# EAGLE design d1 (EAGLE 9.3.2)
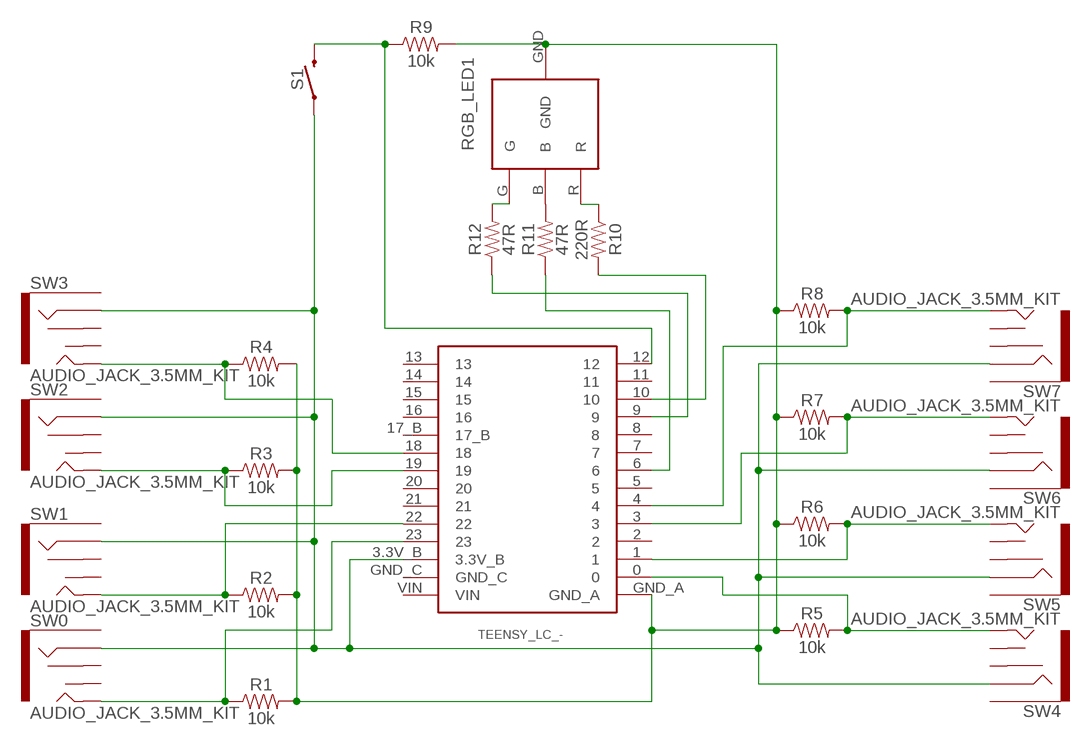
[diagram p0: schematic, sheet 1]

## Parts
R1  10k  10KOHM-HORIZ_KIT-1/4W-1%  [AXIAL-0.3-KIT]
R2  10k  10KOHM-HORIZ_KIT-1/4W-1%  [AXIAL-0.3-KIT]
R3  10k  10KOHM-HORIZ_KIT-1/4W-1%  [AXIAL-0.3-KIT]
R4  10k  10KOHM-HORIZ_KIT-1/4W-1%  [AXIAL-0.3-KIT]
R5  10k  10KOHM-HORIZ_KIT-1/4W-1%  [AXIAL-0.3-KIT]
R6  10k  10KOHM-HORIZ_KIT-1/4W-1%  [AXIAL-0.3-KIT]
R7  10k  10KOHM-HORIZ_KIT-1/4W-1%  [AXIAL-0.3-KIT]
R8  10k  10KOHM-HORIZ_KIT-1/4W-1%  [AXIAL-0.3-KIT]
R9  10k  10KOHM-HORIZ_KIT-1/4W-1%  [AXIAL-0.3-KIT]
R10  220R  10KOHM-HORIZ_KIT-1/4W-1%  [AXIAL-0.3-KIT]
R11  47R  10KOHM-HORIZ_KIT-1/4W-1%  [AXIAL-0.3-KIT]
R12  47R  10KOHM-HORIZ_KIT-1/4W-1%  [AXIAL-0.3-KIT]
RGB_LED1  RGB_LED_THRU  [RGB_LEB_RGB_2]
S1  MOMENTARY-SWITCH-SPST-PTH-6.0MM  [TACTILE_SWITCH_PTH_6.0MM]
SW0  AUDIO_JACK_3.5MM_KIT  [AUDIO-JACK-KIT]
SW1  AUDIO_JACK_3.5MM_KIT  [AUDIO-JACK-KIT]
SW2  AUDIO_JACK_3.5MM_KIT  [AUDIO-JACK-KIT]
SW3  AUDIO_JACK_3.5MM_KIT  [AUDIO-JACK-KIT]
SW4  AUDIO_JACK_3.5MM_KIT  [AUDIO-JACK-KIT]
SW5  AUDIO_JACK_3.5MM_KIT  [AUDIO-JACK-KIT]
SW6  AUDIO_JACK_3.5MM_KIT  [AUDIO-JACK-KIT]
SW7  AUDIO_JACK_3.5MM_KIT  [AUDIO-JACK-KIT]
U$1  TEENSY_LC_-  [TEENSY_LC_-]

## Nets
GND: R1.P$2 R2.P$2 R3.P$2 R4.P$2 R5.P$1 R6.P$1 R7.P$1 R8.P$1 R9.P$2 RGB_LED1.GND U$1.GND_A
N$1: R1.P$1 SW0.TIP U$1.23
N$2: R9.P$1 S1.3 U$1.12
N$3: R2.P$1 SW1.TIP U$1.22
N$4: R3.P$1 SW2.TIP U$1.19
N$5: R4.P$1 SW3.TIP U$1.18
N$6: R5.P$2 SW4.TIP U$1.0
N$7: R6.P$2 SW5.TIP U$1.1
N$8: R7.P$2 SW6.TIP U$1.3
N$9: R8.P$2 SW7.TIP U$1.4
N$10: R10.P$2 U$1.10
N$11: R10.P$1 RGB_LED1.R
N$12: R12.P$1 U$1.9
N$13: R11.P$1 U$1.6
N$14: S1.1 SW0.RING SW1.RING SW2.RING SW3.RING SW4.RING SW5.RING SW6.RING SW7.RING U$1.3.3V_B
N$15: R11.P$2 RGB_LED1.B
N$16: R12.P$2 RGB_LED1.G
Unconnected: SW0.RSH SW0.SLEEVE SW0.TSH SW1.RSH SW1.SLEEVE SW1.TSH SW2.RSH SW2.SLEEVE SW2.TSH SW3.RSH SW3.SLEEVE SW3.TSH SW4.RSH SW4.SLEEVE SW4.TSH SW5.RSH SW5.SLEEVE SW5.TSH SW6.RSH SW6.SLEEVE SW6.TSH SW7.RSH SW7.SLEEVE SW7.TSH U$1.2 U$1.5 U$1.7 U$1.8 U$1.11 U$1.13 U$1.14 U$1.15 U$1.16 U$1.17_B U$1.20 U$1.21 U$1.GND_C U$1.VIN

## Library data of the parts
R1-R9 = SparkFun-Resistors:10KOHM: 10kΩ resistor A resistor is a passive two-terminal electrical component that implements electrical resistance as a circuit element. Resistors act to reduce current flow, and, at the same time, act to lower voltage levels within circuits. - Wikipedia; PROD_ID: RES-12183
R10-R12 = SparkFun-Resistors:10KOHM: 10kΩ resistor A resistor is a passive two-terminal electrical component that implements electrical resistance as a circuit element. Resistors act to reduce current flow, and, at the same time, act to lower voltage levels within circuits. - Wikipedia; PROD_ID: RES-12183; VALUE: 10k
RGB_LED1 = my_library:RGB_LED_THRU
S1 = SparkFun-Switches:MOMENTARY-SWITCH-SPST: Momentary Switch (Pushbutton) - SPST Normally-open (NO) SPST momentary switches (buttons, pushbuttons). Variants PTH-12MM - 12mm square, through-hole Momentary Pushbutton Switch - 12mm Square <https://www.sparkfun.com/products/9190> (COM-09190) PTH-6.0MM, PTH-6.0MM-KIT - 6.0mm square, through-hole Mini Pushbutton Switch <https://www.sparkfun.com/products/97> (COM-00097) KIT package intended for soldering kit's - only one side of pads' copper is exposed. PTH-RIGHT-ANGLE-KIT - Right-angle, through-hole Right Angle Tactile Button <https://www.sparkfun.com/products/10791> - Used on SparkFun BigTime Watch Kit <https://www.sparkfun.com/products/11734> SMD-12MM - 12mm square, surface-mount Tactile Button - SMD (12mm) <https://www.sparkfun.com/products/12993> (COM-12993) Used on SparkFun PicoBoard <https://www.sparkfun.com/products/11888> SMD-4.5MM - 4.5mm Square Trackball Switch Used on SparkFun Blackberry Trackballer Breakout <https://www.sparkfun.com/products/13169> SMD-4.6MMX2.8MM - 4.60mm x 2.80mm, surface mount Used on SparkFun SAMD21 Mini Breakout <https://www.sparkfun.com/products/13664> SMD-5.2MM, SMD-5.2-REDUNDANT - 5.2mm square, surface-mount Mini Pushbutton Switch - SMD <https://www.sparkfun.com/products/8720> (COM-08720) Used on Arduino Pro Mini <https://www.sparkfun.com/products/11114> REDUNDANT package connects both switch circuits together SMD-6.0X3.5MM - 6.0 x 3.5mm, surface mount Momentary Reset Switch SMD <https://www.sparkfun.com/products/8229> (COM-08229) SMD-6.2MM-TALL - 6.2mm square, surface mount Tactile Button - SMD (6mm) <https://www.sparkfun.com/products/12992> Used on SparkFun Digital Sandbox <https://www.sparkfun.com/products/12651> SMD-RIGHT-ANGLE - Right-angle, surface mount Used on SparkFun Block for Intel® Edison - Arduino <https://www.sparkfun.com/products/13036>; PROD_ID: SWCH-08441; SF_SKU: COM-00097
SW0 SW1-SW7 = SparkFun-Connectors:AUDIO_JACK_3.5MM: Audio Jack 3.5mm variants of PTH and SMT stereo audio jack with bypass switches. SparkFun Products: SparkFun SparkPunk Sound Kit <[https://www.sparkfun.com/products/11177]> - PTH MP3 Trigger <https://www.sparkfun.com/products/13720> -3.5mm SMD SparkFun PicoBoard <https://www.sparkfun.com/products/11888>- 2.5mm SMD; PROD_ID: CONN-08774; SF_ID: PRT-08032
U$1 = my_library:TEENSY_LC_-

## Board
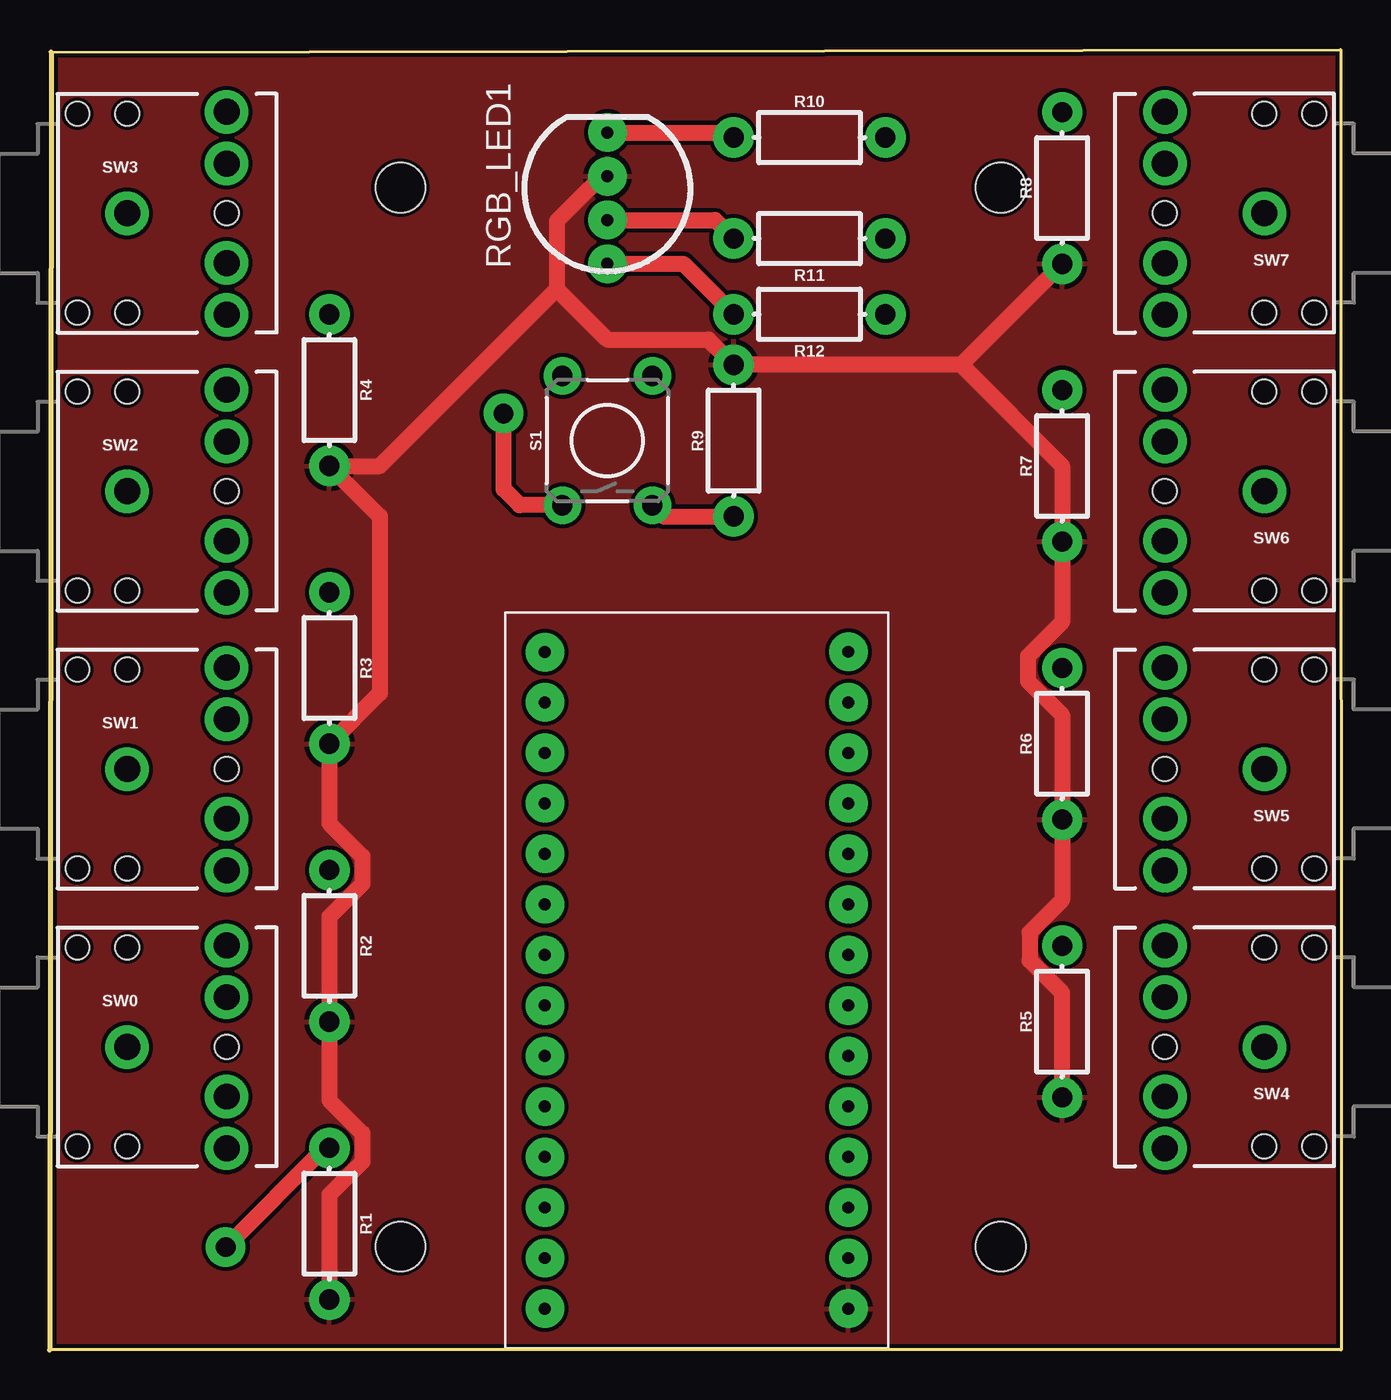
[diagram p1: board, top side]
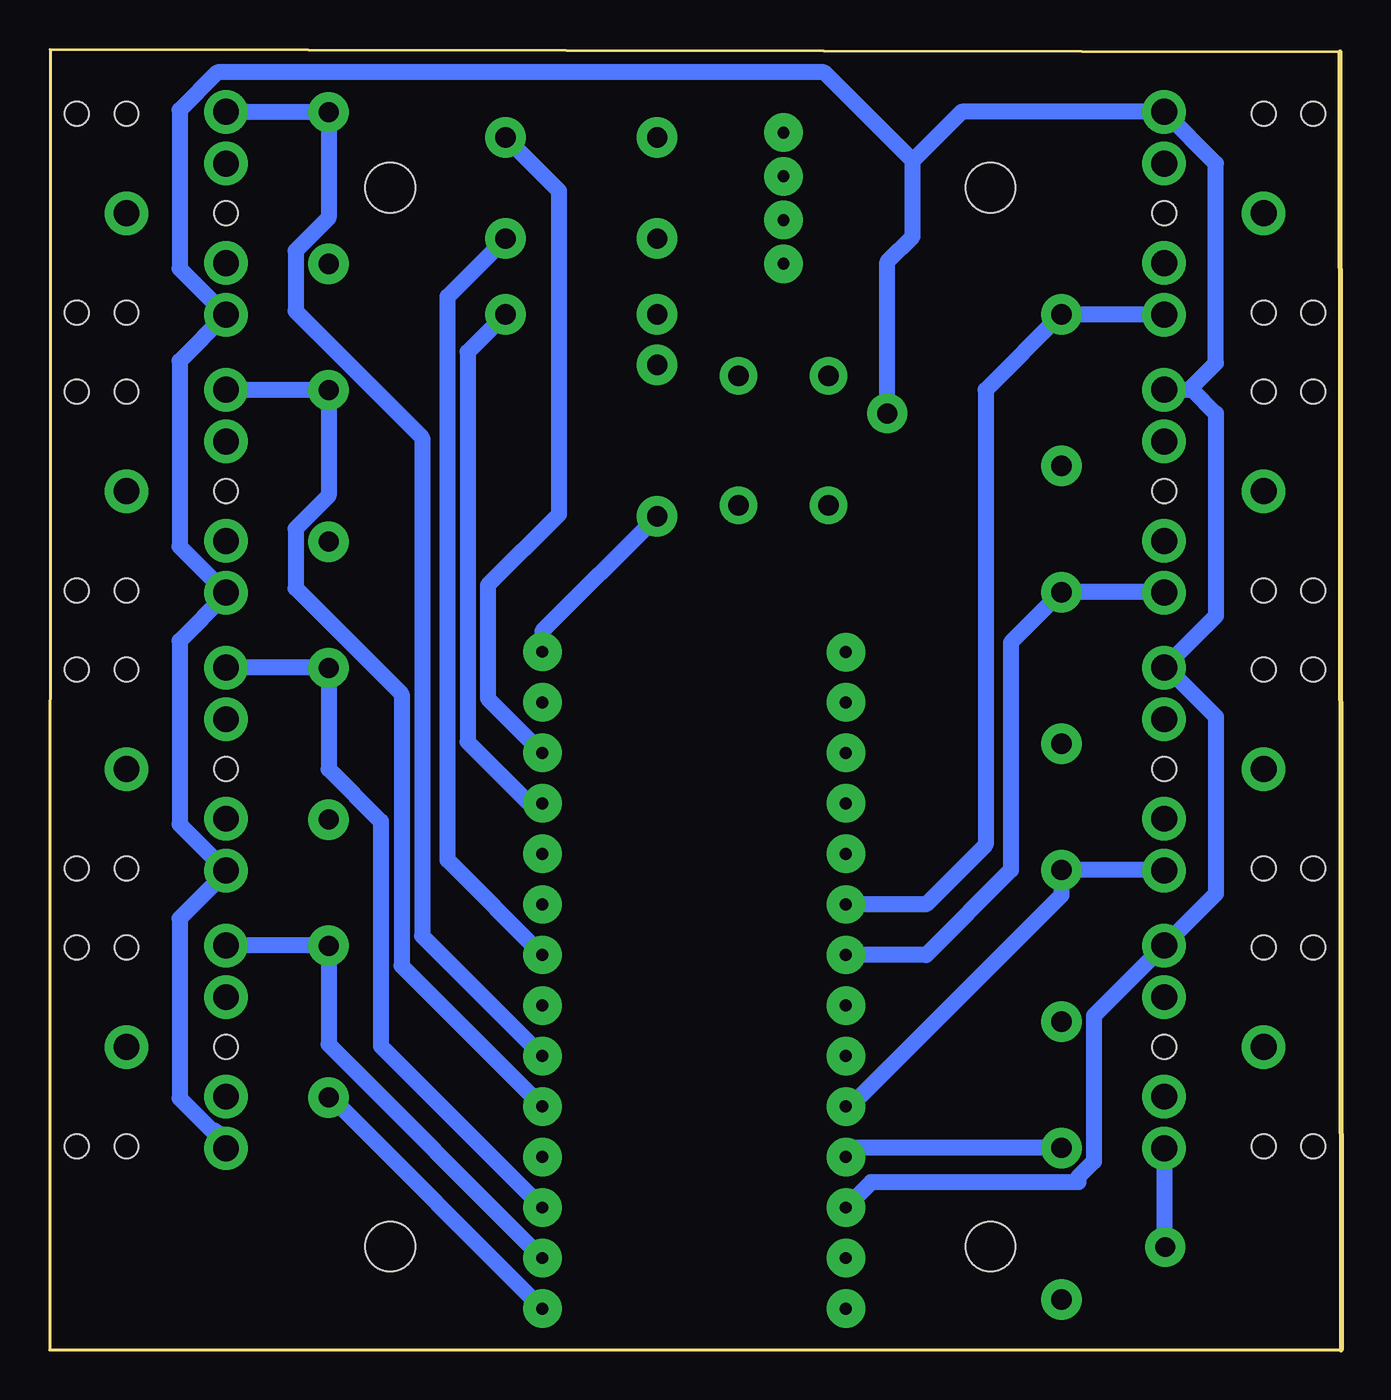
[diagram p2: board, bottom side, seen from below]

Size 64.9 x 65.36 mm. Coordinates in mm from the lower left corner, seen from the top.
Outline: 0.07,65.23 64.88,65.36 64.9,0 0,0 0.07,65.23
Copper layers (1*16): Top 0.035mm / dielectric 1.5mm / Bottom 0.035mm
Design rules "SparkFun": minimum track width 8mil, minimum drill 20mil, track to track 8mil, track to pad 8mil, pad to pad 8mil, via to via 8mil, smd to smd 8mil, copper to edge 8mil, drill to drill 8mil, minimum pad ring 12mil, minimum via ring 10mil, stop-mask expansion 4mil, vias tented up to drill 20mil, thermal gap 10mil
Holes 2.5 mm at 17.62,58.43 47.79,58.43 47.79,5.19 17.62,5.19

### Footprints (pad centres in the part's own frame; a part is rotated, then mirrored left to right if it is on the bottom)
AXIAL-0.3-KIT = drill 1.016 pad 2.032: P$1 -3.81,0; P$2 3.81,0
RGB_LEB_RGB_2 = drill 0.6 pad 1.93: B 2.2,0; G 0,0; GND 4.4,0; R 6.6,0
TACTILE_SWITCH_PTH_6.0MM = drill 1.016 pad 1.88: 1 -3.251,2.261; 2 3.251,2.261; 3 -3.251,-2.261; 4 3.251,-2.261
AUDIO-JACK-KIT = drill 1.3 pad 2.184: RING 5,5.1; RSH 5,2.5; SLEEVE 0,0; TIP 5,-5.1; TSH 5,-2.5 | hole 1.2: 0,5; -2.5,5; -2.5,-5; 0,-5; 5,0
TEENSY_LC_- = drill 0.6 pad 1.93: 0 4.54,-17.25; 1 7.08,-17.25; 2 9.62,-17.25; 3 12.16,-17.25; 3.3V_B 7.08,-2; 4 14.7,-17.25; 5 17.24,-17.25; 6 19.78,-17.25; 7 22.32,-17.25; 8 24.86,-17.25; 9 27.4,-17.25; 10 29.94,-17.25; 11 32.48,-17.25; 12 35.02,-17.25; 13 35,-2; 14 32.48,-2; 15 29.94,-2; 16 27.4,-2; 17_B 24.86,-2; 18 22.32,-2; 19 19.78,-2; 20 17.24,-2; 21 14.7,-2; 22 12.16,-2; 23 9.62,-2; GND_A 2,-17.25; GND_C 4.54,-2; VIN 2,-2

### Placement (x,y rotation side)
R1  14.05,6.34 270 top
R2  14.05,20.31 270 top
R3  14.05,34.28 270 top
R4  14.05,48.25 270 top
R5  50.88,16.5 90 top
R6  50.88,30.47 90 top
R7  50.88,44.44 90 top
R8  50.88,58.41 90 top
R9  34.37,45.71 90 top
R10  38.18,60.95 0 top
R11  38.18,55.87 180 top
R12  38.18,52.06 180 top
RGB_LED1  28.02,54.6 90 top
S1  28.02,45.71 90 top
SW0  3.89,15.23 0 top
SW1  3.89,29.2 0 top
SW2  3.89,43.17 0 top
SW3  3.89,57.14 0 top
SW4  61.04,15.23 180 top
SW5  61.04,29.2 180 top
SW6  61.04,43.17 180 top
SW7  61.04,57.14 180 top
U$1  22.89,0.07 90 top

### Tracks (layer width: path | path; a pad name or v marks a point on that pad's centre or on a via)
GND
  Top 0.813: R8.P$1 45.8,49.52 | 45.8,49.52 R9.P$2 33.1,50.79 28.02,50.79 25.48,53.33 | 45.8,49.52 50.88,44.44 R7.P$1 50.88,36.59 49.16,34.87 49.16,33.62 50.88,31.9 R6.P$1 50.88,22.62 49.25,20.98 49.25,19.57 50.88,17.93 R5.P$1 | RGB_LED1.GND 27.75,59 25.48,56.73 25.48,53.33 | 25.48,53.33 16.59,44.44 R4.P$2 16.59,41.9 16.59,33.01 R3.P$2 14.05,26.47 15.71,24.81 15.71,23.42 14.05,21.76 R2.P$2 14.05,12.54 15.71,10.88 15.71,9.45 14.05,7.79 R1.P$2
  Bottom 0.813: U$1.GND_A 50.75,12.69 R5.P$1
  pour Top: 0.08,65.27 64.9,65.27 64.9,0 0.08,0
  pour Top: 0.08,65.27 64.9,65.27 64.9,0.03 0.08,0.03
N$1  (via drill 1 pad 2)
  Top 0.813: v8.84,5.16 13.82,10.15 R1.P$1
  Bottom 0.813: R1.P$1 24.43,10.15 U$1.23 | SW0.TIP 8.89,5.22 v8.84,5.16
N$2
  Top 0.813: S1.3 30.84,41.9 R9.P$1
  Bottom 0.813: R9.P$1 40.14,36.13 U$1.12
N$3
  Bottom 0.813: U$1.22 24.67,12.23 14.05,22.85 R2.P$1 8.91,24.12 SW1.TIP
N$4
  Bottom 0.813: U$1.19 20.86,19.85 16.59,24.12 16.59,35.55 R3.P$1 8.91,38.09 SW2.TIP
N$5
  Bottom 0.813: U$1.18 20.86,22.39 17.86,25.39 17.86,48.25 R4.P$1 14.03,52.04 SW3.TIP
N$6
  Bottom 0.813: U$1.0 50.88,15.36 R5.P$2 50.9,20.33 SW4.TIP
N$7
  Bottom 0.813: U$1.1 48.26,15.27 48.26,26.57 50.88,29.2 R6.P$2 50.9,34.3 SW5.TIP
N$8
  Bottom 0.813: U$1.3 47.21,19.3 47.21,32.96 52.54,38.29 52.54,41.28 50.88,42.94 R7.P$2 56.02,48.25 SW6.TIP
N$9
  Bottom 0.813: U$1.4 46.18,20.81 46.18,45.85 52.54,52.22 52.54,55.25 50.88,56.91 R8.P$2 50.9,62.24 SW7.TIP
N$10
  Bottom 0.813: R10.P$2 39.32,58.27 39.32,41.99 42.88,38.43 42.88,32.75 U$1.10
N$11
  Top 0.813: RGB_LED1.R 34.12,61.2 R10.P$1
N$12
  Bottom 0.813: R12.P$1 43.89,50.16 43.89,30.56 40.8,27.47 U$1.9
N$13
  Bottom 0.813: R11.P$1 44.91,52.95 44.91,24.62 U$1.6
N$14  (via drill 1 pad 2)
  Top 0.813: S1.1 23.61,42.46 22.81,43.26 v22.81,47.07
  Bottom 0.813: U$1.3.3V_B 23.62,8.42 13.2,8.42 13.2,8.7 12.43,9.47 12.43,16.79 SW0.RING 6.3,22.92 6.3,31.83 8.76,34.3 SW1.RING 6.3,36.89 6.3,47.07 7.49,48.27 SW2.RING 7.64,48.27 6.3,49.61 6.3,59.64 SW3.RING 19.07,62.24 21.54,59.77 | SW4.RING 56.04,10.46 56.61,11.02 56.75,11.02 58.37,12.64 58.37,21.67 56.04,24 SW5.RING 58.37,26.42 58.37,35.64 56.04,37.97 SW6.RING 58.37,40.39 58.37,49.71 SW7.RING 58.37,54.36 58.37,62.32 56.47,64.22 25.98,64.22 21.54,59.77 | v22.81,47.07 22.81,54.69 21.54,55.96 21.54,59.77
N$15
  Top 0.813: RGB_LED1.B 33.44,56.8 R11.P$2
N$16
  Top 0.813: RGB_LED1.G 31.83,54.6 R12.P$2